# EAGLE design usb_rs485_fd_v1b (EAGLE 5.07)
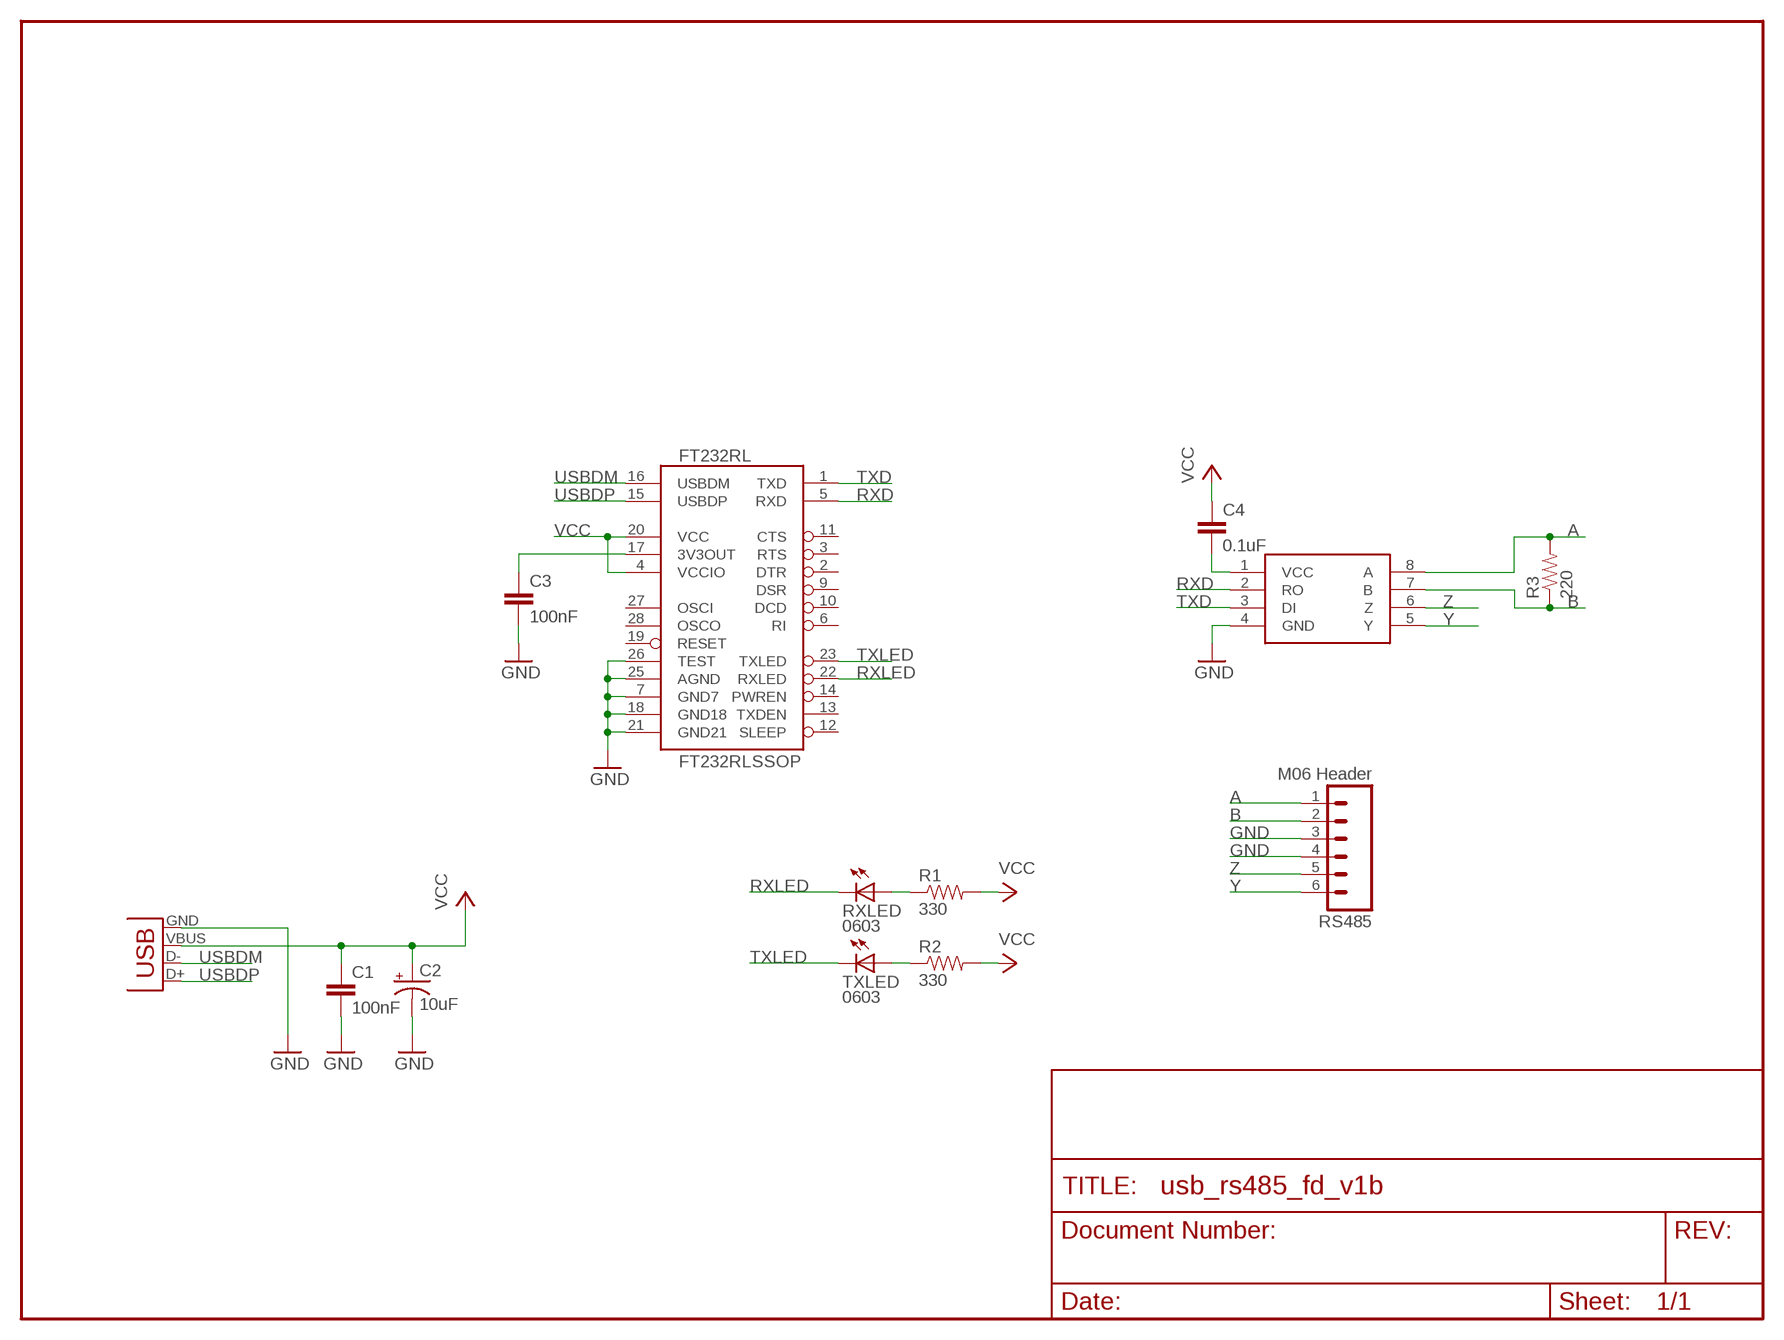
[diagram p0: schematic, sheet 1]

## Parts
C1  100nF  CAP0603-CAP  [0603-CAP]
C2  10uF  CAP_POL1206  [EIA3216]
C3  100nF  CAP0603-CAP  [0603-CAP]
C4  0.1uF  CAP0603-CAP  [0603-CAP]
FT232RL  FT232RLSSOP  [SSOP28DB]
MAX3077  MAX3087  [SO08]
R1  330  RESISTOR0603-RES  [0603-RES]
R2  330  RESISTOR0603-RES  [0603-RES]
R3  220  RESISTOR0603-RES  [0603-RES]
RS485  M06 Header  M06SIP  [1X06]
RXLED  0603  LED0603  [LED-0603]
TXLED  0603  LED0603  [LED-0603]
USB_MINI_B  USBSMD  [USB-MINIB]

## Nets
A: MAX3077.8(A) R3.2 RS485.1
B: MAX3077.7(B) R3.1 RS485.2
GND [supply]: C1.2 C2.C(-) C3.2 FT232RL.7(GND7) FT232RL.18(GND18) FT232RL.21(GND21) FT232RL.25(AGND) FT232RL.26(TEST) MAX3077.4(GND) RS485.3 RS485.4 USB_MINI_B.GND
N$1: R1.1 RXLED.A
N$2: R2.1 TXLED.A
N$3: C3.1 FT232RL.17(3V3OUT)
N$4: C4.2 MAX3077.1(VCC)
RXD: FT232RL.5(RXD) MAX3077.2(RO)
RXLED: FT232RL.22(RXLED) RXLED.C
TXD: FT232RL.1(TXD) MAX3077.3(DI)
TXLED: FT232RL.23(TXLED) TXLED.C
USBDM: FT232RL.16(USBDM) USB_MINI_B.D-
USBDP: FT232RL.15(USBDP) USB_MINI_B.D+
VCC [supply]: C1.1 C2.A(+) C4.1 FT232RL.4(VCCIO) FT232RL.20(VCC) R1.2 R2.2 USB_MINI_B.VBUS
Y: MAX3077.5(Y) RS485.6
Z: MAX3077.6(Z) RS485.5
Unconnected: FT232RL.2(DTR) FT232RL.3(RTS) FT232RL.6(RI) FT232RL.9(DSR) FT232RL.10(DCD) FT232RL.11(CTS) FT232RL.12(SLEEP) FT232RL.13(TXDEN) FT232RL.14(PWREN) FT232RL.19(RESET) FT232RL.27(OSCI) FT232RL.28(OSCO)

## Library data of the parts
C1 C3 C4 = SparkFun:CAP: Capacitor Standard 0603 ceramic capacitor, and 0.1" leaded capacitor.
C2 = SparkFun:CAP_POL: Capacitor Polarized These are standard SMD and PTH capacitors. Normally 10uF, 47uF, and 100uF in electrolytic and tantalum varieties. Always verify the external diameter of the through hole cap, it varies with capacity, voltage, and manufacturer. The EIA devices should be standard.
FT232RL = SparkFun:FT232RL: USB UART FT232RL 4th Generation USB UART (USB <-> Serial) Controller. Spark Fun Electronics SKU : COM-00650
MAX3077 = jcole:MAX3087
R1-R3 = SparkFun:RESISTOR: Resistor Basic schematic elements and footprints for 0603, 1206, and PTH 1/10th watt (small) resistors.
RS485 = SparkFun:M06: Header 6 Standard 6-pin 0.1" header. Use with straight break away headers (SKU : PRT-00116), right angle break away headers (PRT-00553), swiss pins (PRT-00743), machine pins (PRT-00117), and female headers (PRT-00115). Molex polarized connector foot print use with SKU : PRT-08094 with associated crimp pins and housings. NOTES ON THE VARIANTS LOCK and LOCK_LONGPADS... This footprint was designed to help hold the alignment of a through-hole component (i.e. 6-pin header) while soldering it into place. You may notice that each hole has been shifted either up or down by 0.005 of an inch from it's more standard position (which is a perfectly straight line). This slight alteration caused the pins (the squares in the middle) to touch the edges of the holes. Because they are alternating, it causes a "brace" to hold the component in place. 0.005 has proven to be the perfect amount of "off-center" position when using our standard breakaway headers. Although looks a little odd when you look at the bare footprint, once you have a header in there, the alteration is very hard to notice. Also, if you push a header all the way into place, it is covered up entirely on the bottom side. This idea of altering the position of holes to aid alignment will be further integrated into the Sparkfun Library for other footprints. It can help hold any component with 3 or more connection pins.
RXLED TXLED = SparkFun:LED: LEDs Standard schematic elements and footprints for 5mm, 3mm, 1206, and 0603 sized LEDs. 5mm - Spark Fun Electronics SKU : COM-00529 (and others)
USB_MINI_B = SparkFun:USB: USB Connectors USB-B-PTH is fully proven SKU : PRT-00139 USB-miniB is fully proven SKU : PRT-00587 USB-A-PCB is untested. USB-A-H is throughly reviewed, but untested. Spark Fun Electronics SKU : PRT-00437 USB-B-SMT is throughly reviewed, but untested. Needs silkscreen touching up. USB-A-S has not been used/tested USB-MB-H has not been used/tested

## Net classes
0 signal: width 0.152 mm
1 supply: width 0.305 mm

## Board
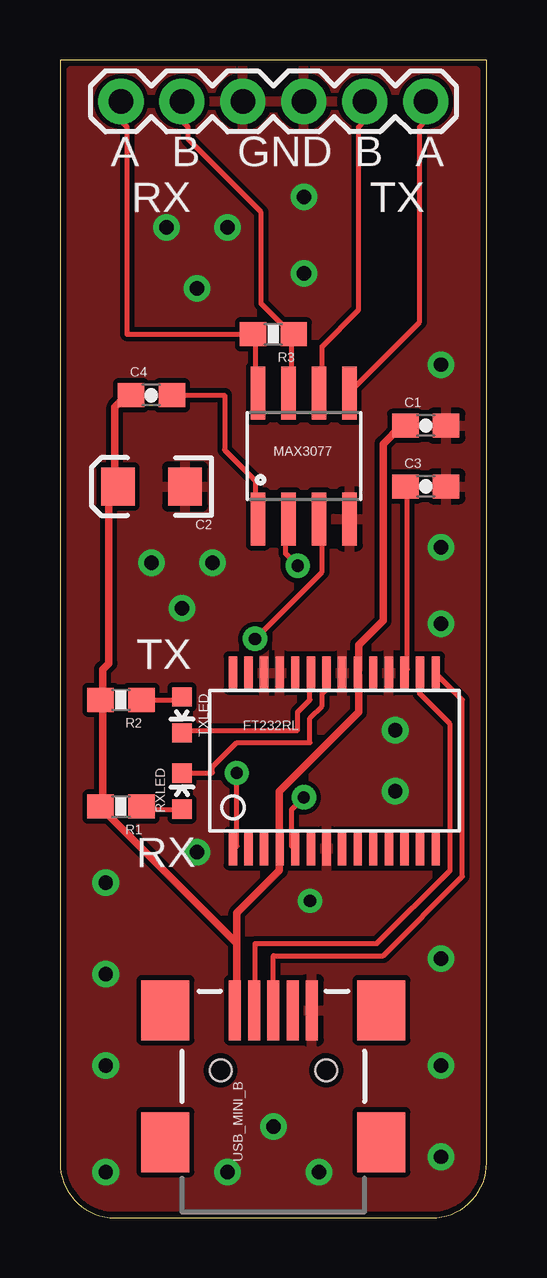
[diagram p1: board, top side]
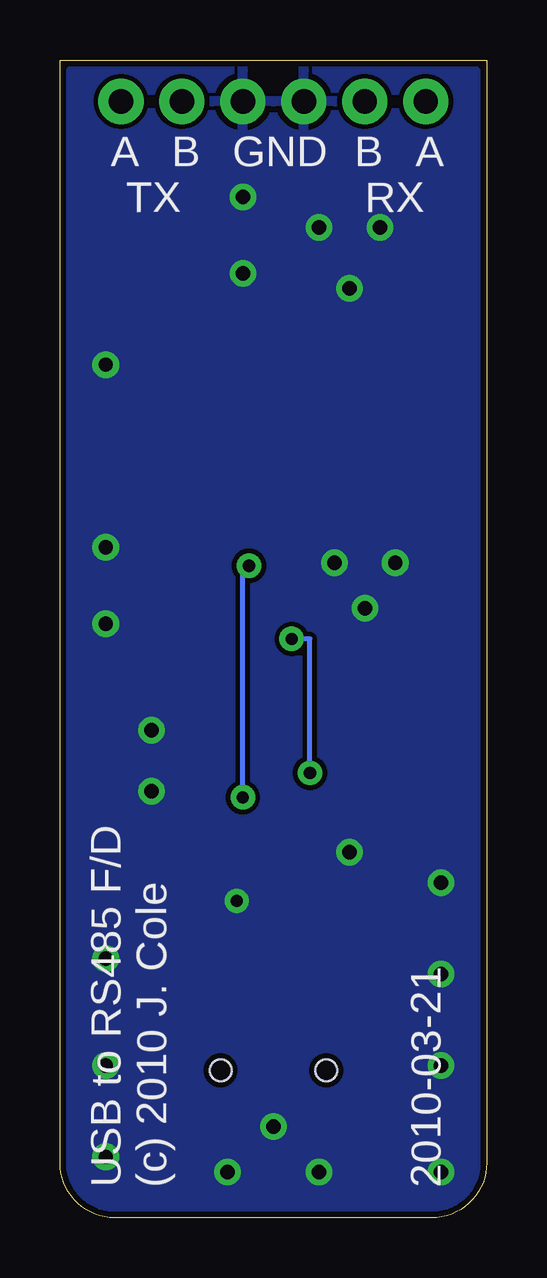
[diagram p2: board, bottom side, seen from below]

Size 17.78 x 48.26 mm. Coordinates in mm from the lower left corner, seen from the top.
Outline: 0,48.26 0,2.29 arc90 2.29,0 15.49,0 arc90 17.78,2.29 17.78,48.26 0,48.26
Copper layers (1*16): Top 0.035mm / dielectric 1.5mm / Bottom 0.035mm
Design rules "SparkFun": minimum track width 8mil, minimum drill 20mil, track to track 8mil, track to pad 8mil, pad to pad 8mil, via to via 8mil, smd to smd 8mil, copper to edge 10mil, drill to drill 8mil, minimum pad ring 12mil, minimum via ring 10mil, stop-mask expansion 4mil, vias tented up to drill 25mil, thermal gap 10mil

### Footprints (pad centres in the part's own frame; a part is rotated, then mirrored left to right if it is on the bottom)
0603-CAP = smd 1.1 x 1: 1 -0.85,0; 2 0.85,0
EIA3216 = smd 1.4 x 1.6: A 1.4,0; C -1.4,0
SSOP28DB = smd 0.348 x 1.397: 1 -4.225,-3.656; 2 -3.575,-3.656; 3 -2.925,-3.656; 4 -2.275,-3.656; 5 -1.625,-3.656; 6 -0.975,-3.656; 7 -0.325,-3.656; 8 0.325,-3.656; 9 0.975,-3.656; 10 1.625,-3.656; 11 2.275,-3.656; 12 2.925,-3.656; 13 3.575,-3.656; 14 4.225,-3.656; 15 4.225,3.656; 16 3.575,3.656; 17 2.925,3.656; 18 2.275,3.656; 19 1.625,3.656; 20 0.975,3.656; 21 0.325,3.656; 22 -0.325,3.656; 23 -0.975,3.656; 24 -1.625,3.656; 25 -2.275,3.656; 26 -2.925,3.656; 27 -3.575,3.656; 28 -4.225,3.656
SO08 = smd 0.61 x 2.21: 1 -1.905,-2.616; 2 -0.635,-2.616; 3 0.635,-2.616; 4 1.905,-2.616; 5 1.905,2.616; 6 0.635,2.616; 7 -0.635,2.616; 8 -1.905,2.616
0603-RES = smd 1.1 x 1: 1 -0.85,0; 2 0.85,0
1X06 = drill 1.016 pad 1.88 round: 1 0,0; 2 2.54,0; 3 5.08,0; 4 7.62,0; 5 10.16,0; 6 12.7,0
LED-0603 = smd 0.8 x 0.8: A 0,-0.75; C 0,0.75
USB-MINIB = smd 2.5 x 0.5: D+ 2.5,0; D- 2.5,0.8; GND 2.5,-1.6; ID 2.5,-0.8; VBUS 2.5,1.6 | smd 2.5 x 2: GND@1 -3,-4.5; GND@2 -3,4.5; GND@3 2.5,4.5; GND@4 2.5,-4.5 | hole 0.9: 0,2.2; 0,-2.2

### Placement (x,y rotation side)
C1  15.24,33.02 0 top
C2  3.81,30.48 180 top
C3  15.24,30.48 0 top
C4  3.81,34.29 0 top
FT232RL  11.43,19.05 0 top
MAX3077  10.16,31.75 0 top
R1  2.54,17.14 180 top
R2  2.54,21.59 180 top
R3  8.89,36.83 180 top
RS485  2.54,46.53 0 top
RXLED  5.08,17.78 0 top
TXLED  5.08,20.95 180 top
USB_MINI_B  8.89,6.15 90 top

### Tracks (layer width: path | path; a pad name or v marks a point on that pad's centre or on a via)
A
  Top 0.203: MAX3077.8 8.13,34.54 8.13,36.83 R3.2 2.79,36.83 2.79,45.47 2.54,45.72 RS485.1
B
  Top 0.203: 9.65,36.83 9.65,34.54 MAX3077.7 | 9.65,36.83 8.38,38.1 8.38,41.91 5.33,44.96 5.33,45.47 5.08,45.72 RS485.2 | 9.65,36.83 R3.1
GND  (via drill 0.51, 0.6)
  other vias: 10.41,13.21 4.45,41.27 5.71,38.73 6.99,41.27 10.16,42.55 10.16,39.37 15.88,35.56 15.88,27.94 15.88,24.77 6.35,27.3 3.81,27.3 5.08,25.4 1.91,13.97 1.91,10.16 1.91,6.35 1.91,1.91 6.99,1.91 8.89,3.81 10.79,1.91 15.88,2.54 15.88,6.35 15.88,10.79 5.71,15.24 13.97,20.32 13.97,17.78
  pour Bottom: 0.46,47.8 17.32,47.8 17.32,0.46 0.46,0.46
  pour Top: 0.46,47.8 17.32,47.8 17.32,0.46 0.46,0.46
N$1
  Top 0.203: RXLED.A 5.08,17.02 3.56,17.02 R1.1
N$2
  Top 0.203: TXLED.A 5.08,21.59 R2.1
N$3
  Top 0.203: C3.1 14.48,30.48 14.48,22.86 FT232RL.17
N$4
  Top 0.203: C4.2 6.86,34.29 6.86,32 8.13,30.73 8.13,29.21 MAX3077.1
RXD  (via drill 0.51)
  Top 0.203: v10.16,17.53 9.65,17.02 9.65,15.49 FT232RL.5 | v9.91,27.18 9.4,27.69 9.4,28.96 MAX3077.2
  Bottom 0.203: v10.16,17.53 10.16,27.18 v9.91,27.18
RXLED
  Top 0.203: RXLED.C 5.08,18.54 6.35,18.54 6.35,18.8 7.37,19.81 10.41,19.81 10.41,20.83 10.92,21.34 10.92,21.84 11.18,22.1 11.18,22.61 FT232RL.22
TXD  (via drill 0.51)
  Top 0.203: v7.37,18.54 7.37,15.49 FT232RL.1 | v8.13,24.13 10.92,26.92 10.92,28.96 MAX3077.3
  Bottom 0.203: v7.37,18.54 7.37,24.13 v8.13,24.13
TXLED
  Top 0.203: TXLED.C 5.08,20.32 9.91,20.32 9.91,21.08 10.41,21.59 10.41,22.61 FT232RL.23
USBDM
  Top 0.203: FT232RL.16 14.99,22.61 14.99,21.84 16.26,20.57 16.26,14.48 13.21,11.43 8.13,11.43 8.13,8.89 USB_MINI_B.D-
USBDP
  Top 0.203: FT232RL.15 15.75,22.61 16.76,21.59 16.76,14.22 13.46,10.92 8.89,10.92 USB_MINI_B.D+
VCC
  Top 0.305: C1.1 14.22,33.02 13.46,32.26 13.46,24.89 12.45,23.88 12.45,22.86 FT232RL.20 12.45,22.61 12.45,21.08 9.14,17.78 9.14,15.49 FT232RL.4 9.14,15.24 9.14,14.48 7.37,12.7 7.37,11.43 | 2.29,30.48 2.29,33.78 2.79,34.29 C4.1 | 1.78,21.59 1.78,17.27 R1.2 1.78,17.02 7.37,11.43 | 7.37,11.43 7.37,8.89 USB_MINI_B.VBUS | 2.29,30.48 2.03,30.23 2.03,23.11 1.78,22.86 1.78,21.59 | 2.29,30.48 C2.A | 1.78,21.59 R2.2
Y
  Top 0.203: MAX3077.5 12.19,34.54 14.99,37.34 14.99,45.47 15.24,45.72 RS485.6
Z
  Top 0.203: MAX3077.6 10.92,34.54 10.92,36.32 12.45,37.85 12.45,45.47 12.7,45.72 RS485.5

### Text on the board
tPlace: A | B | GND | B | A | RX | TX | TX | RX
bPlace: A | B | GND | B | A | RX | TX | 2010-03-21 | (c) 2010 J. Cole | USB to RS485 F/D